# EAGLE design PulseFit (EAGLE 9.6.2)
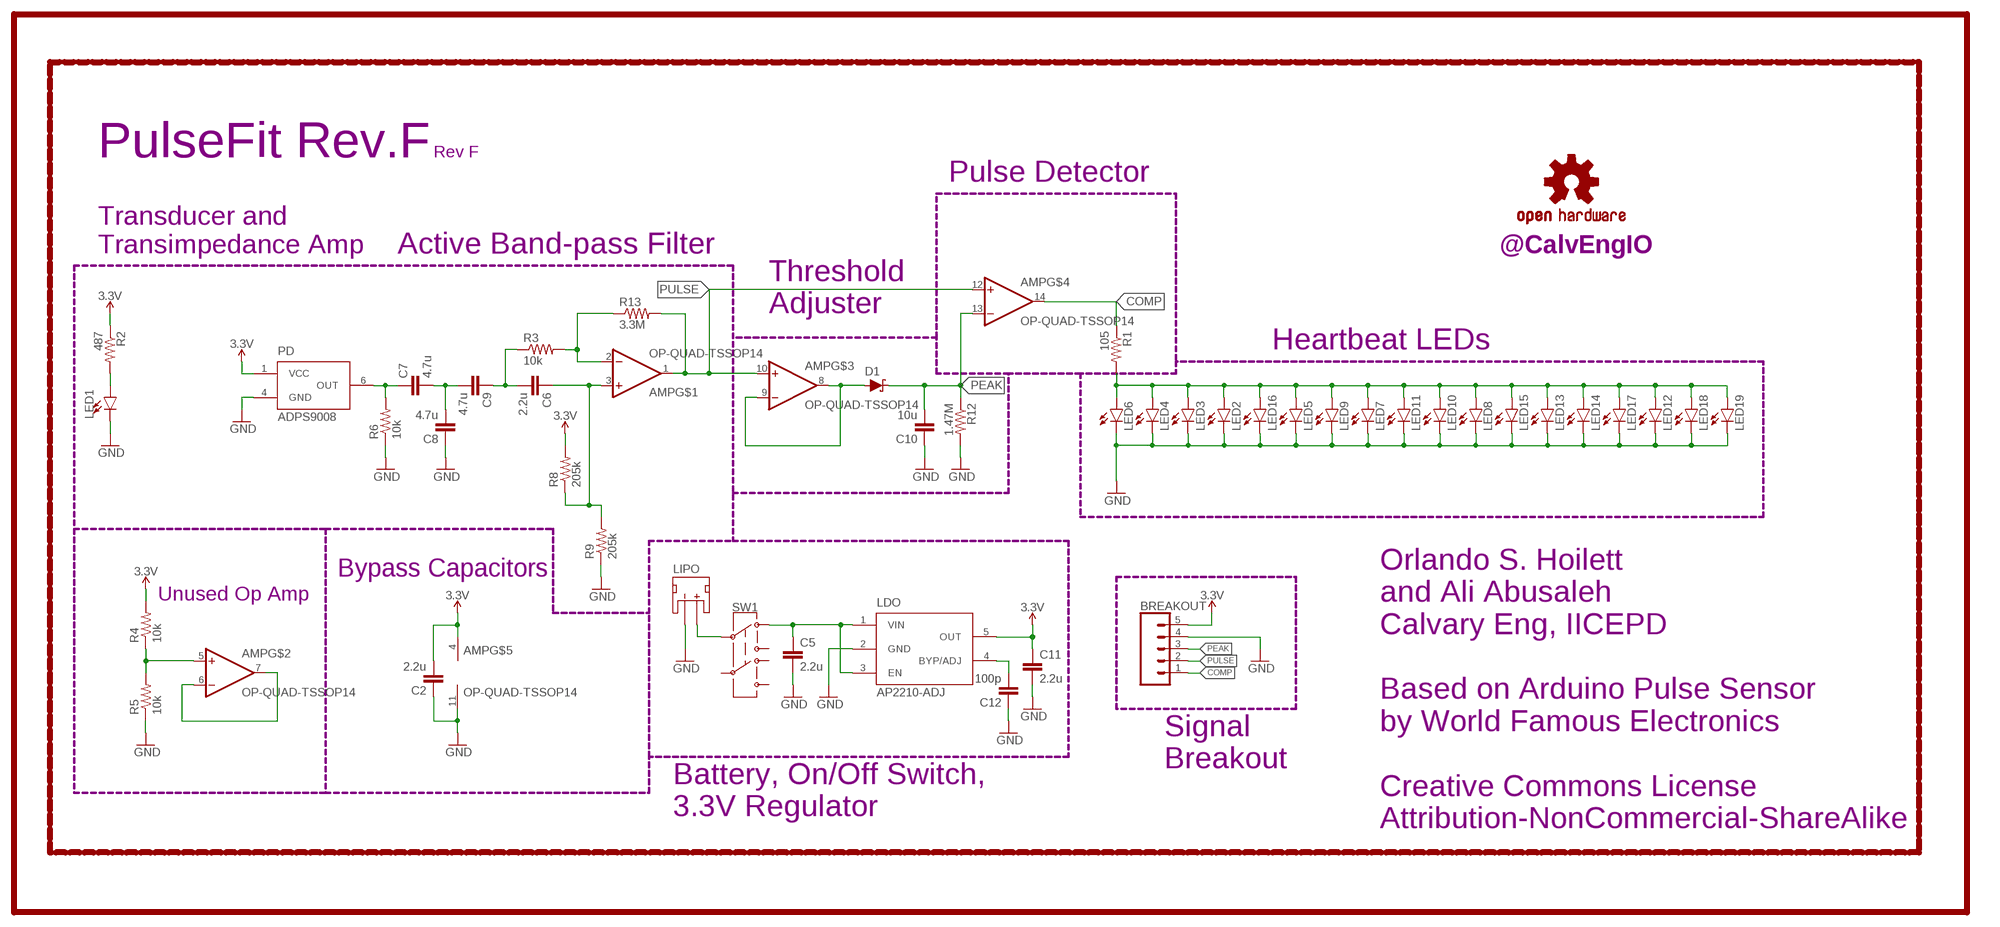
[diagram p0: schematic, sheet 1]

## Parts
AMP  OP-QUAD-TSSOP14  [TSSOP14]
BREAKOUT  CONN_05NO_SILK  [1X05_NO_SILK]
C2  2.2u  CAPACITOR0402  [C0402]
C5  2.2u  CAPACITOR0603  [C0603]
C6  2.2u  CAPACITOR0603  [C0603]
C7  4.7u  CAPACITOR0603  [C0603]
C8  4.7u  CAPACITOR0603  [C0603]
C9  4.7u  CAPACITOR0603  [C0603]
C10  10u  CAPACITOR0805  [C0805]
C11  2.2u  CAPACITOR0603  [C0603]
C12  100p  CAPACITOR0402  [C0402]
D1  SCHOTTKY-USC  [USC]
LDO  AP2210-ADJ  [SOT23-5]
LED1  LEDZ-BEND  [2-SMD.Z-BEND]
LED2  LED5MM  [LED5MM]
LED3  LED5MM  [LED5MM]
LED4  LED5MM  [LED5MM]
LED5  LED5MM  [LED5MM]
LED6  LED5MM  [LED5MM]
LED7  LED5MM  [LED5MM]
LED8  LED5MM  [LED5MM]
LED9  LED5MM  [LED5MM]
LED10  LED5MM  [LED5MM]
LED11  LED5MM  [LED5MM]
LED12  LED5MM  [LED5MM]
LED13  LED5MM  [LED5MM]
LED14  LED5MM  [LED5MM]
LED15  LED5MM  [LED5MM]
LED16  LED5MM  [LED5MM]
LED17  LED5MM  [LED5MM]
LED18  LED5MM  [LED5MM]
LED19  LED5MM  [LED5MM]
LIPO  JST_2MM_MALE  [JST-2-SMD]
LOGO1  OSHW-LOGOS  [OSHW-LOGO-S]
PD  ADPS9008  [6-PIN.CHIPLED]
R1  105  RESISTOR0402  [R0402]
R2  487  RESISTOR0402  [R0402]
R3  10k  RESISTOR0402  [R0402]
R4  10k  RESISTOR0402  [R0402]
R5  10k  RESISTOR0402  [R0402]
R6  10k  RESISTOR0402  [R0402]
R8  205k  RESISTOR0402  [R0402]
R9  205k  RESISTOR0402  [R0402]
R12  1.47M  RESISTOR0402  [R0402]
R13  3.3M  RESISTOR0402  [R0402]
SW1  SWITCH.JS202011JCQN  [SWITCH.00]
U$1  CALVENGIO_HANDLEHANDLE.05  [CALVENGIO_HANDLE.05]
U$2  REVISION.F  [REV.F]

## Nets
3.3V: AMP.4(V+) BREAKOUT.5 C2.2 C11.1 LDO.5(OUT) PD.1(VCC) R2.1 R4.2 R8.2
ANODE: LED2.A LED3.A LED4.A LED5.A LED6.A LED7.A LED8.A LED9.A LED10.A LED11.A LED12.A LED13.A LED14.A LED15.A LED16.A LED17.A LED18.A LED19.A R1.2
COMP: AMP.14(OUT) BREAKOUT.1 R1.1
GND: AMP.11(V-) BREAKOUT.4 C2.1 C5.2 C8.1 C10.1 C11.2 C12.1 LDO.2(GND) LED1.-(C) LED2.K(C) LED3.K(C) LED4.K(C) LED5.K(C) LED6.K(C) LED7.K(C) LED8.K(C) LED9.K(C) LED10.K(C) LED11.K(C) LED12.K(C) LED13.K(C) LED14.K(C) LED15.K(C) LED16.K(C) LED17.K(C) LED18.K(C) LED19.K(C) LIPO.1(-) PD.4(GND) R5.1 R6.1 R9.1 R12.2
N$1: AMP.5(+IN) R4.1 R5.2
N$2: AMP.6(-IN) AMP.7(OUT)
N$3: C12.2 LDO.4(BYP/ADJ)
N$4: LIPO.2(+) SW1.2
N$5: LED1.+(A) R2.2
N$10: AMP.8(OUT) AMP.9(-IN) D1.+(A)
N$11: C5.1 LDO.1(VIN) LDO.3(EN) SW1.1
N$13: C7.2 C8.2 C9.2
N$14: C6.2 C9.1 R3.1
N$15: AMP.2(-IN) R3.2 R13.1
N$17: AMP.3(+IN) C6.1 R8.1 R9.2
N$18: C7.1 PD.6(OUT) R6.2
PEAK: AMP.13(-IN) BREAKOUT.3 C10.2 D1.-(C) R12.1
PULSE: AMP.1(OUT) AMP.10(+IN) AMP.12(+IN) BREAKOUT.2 R13.2
Unconnected: LIPO.NC1(PAD1) LIPO.NC2(PAD2) SW1.3 SW1.5 SW1.6 SW1.7

## Notes on the sheet
- PulseFit Rev.F
- Pulse Detector
- Transducer and
  Transimpedance Amp
- Active Band-pass Filter
- Threshold
  Adjuster
- Heartbeat LEDs
- Bypass Capacitors
- Unused Op Amp
- Signal
  Breakout
- Battery, On/Off Switch,
  3.3V Regulator
- Orlando S. Hoilett
  and Ali Abusaleh
  Calvary Eng, IICEPD
  
  Based on Arduino Pulse Sensor
  by World Famous Electronics
  
  Creative Commons License
  Attribution-NonCommercial-ShareAlike

## Library data of the parts
AMP = CalvEngIO-AnalogIC:OP-QUAD: General symbol and footprints for Quad Op Amps. Use with any standard general purpose op amp.
BREAKOUT = CalvEngIO-Connectors:CONN_05: Multi connection point. Often used as Generic Header-pin footprint for 0.1 inch spaced/style header connections On any of the 0.1 inch spaced packages, you can populate with these: Break Away Headers - Straight <https://www.sparkfun.com/products/116> (PRT-00116) Break Away Male Headers - Right Angle <https://www.sparkfun.com/products/553> (PRT-00553) Female Headers <https://www.sparkfun.com/products/115> (PRT-00115) Break Away Headers - Machine Pin <https://www.sparkfun.com/products/117> (PRT-00117) Break Away Female Headers - Swiss Machine Pin <https://www.sparkfun.com/products/743> (PRT-00743) For SCREWTERMINALS and SPRING TERMINALS visit here: Screw Terimnals on SparkFun.com <https://www.sparkfun.com/search/results?term=Screw+Terminals> (5mm/3.5mm/2.54mm spacing) This device is also useful as a general connection point to wire up your design to another part of your project. Our various solder wires solder well into these plated through hole pads. Hook-Up Wire - Assortment (Stranded, 22 AWG) <https://www.sparkfun.com/products/11375> (PRT-11375) Hook-Up Wire - Assortment (Solid Core, 22 AWG) <https://www.sparkfun.com/products/11367> (PRT-11367) View the entire wire category on our website here <https://www.sparkfun.com/categories/141> Special notes: Molex polarized connector foot print use with SKU : PRT-08231 with associated crimp pins and housings. 1MM SMD Version SKU: PRT-10208
C2 C5-C12 = CalvEngIO-Passives:CAPACITOR
D1 = CalvEngIO-DiscreteSemi:SCHOTTKY: Schottky diode A Schottky diode is a semiconductor diode which has a low forward voltage drop and a very fast switching action. Example: Digi-Key Part Number: RB161MM-20CT-ND
LDO = CalvEngIO-Power:AP2210-ADJ
LED1 = CalvEngIO-LED:LED: LED (Generic) Standard schematic elements and footprints for 5mm, 3mm, 1206, and 0603 sized LEDs. Generic LEDs with no color specified. LTST-C190KGKT: arrow indicates cathode
LED2-LED19 = SparkFun-LED:LED: LEDs Standard schematic elements and footprints for 5mm, 3mm, 1206, and 0603 sized LEDs. 5mm - Spark Fun Electronics SKU : COM-00529 (and others)
LIPO = CalvEngIO-Connectors:JST_2MM_MALE: JST 2MM MALE RA CONNECTOR Two pin, compact surface mount connector. Commonly used as a battery input connection point. We really like the solid locking feeling and high current rating on these small connectors. We use these all the time as battery connectors. Mates to single-cell LiPo batteries. Here is the connector we sell at SparkFun: JST Right Angle Connector - White <https://www.sparkfun.com/products/8612> (PRT-08612) Datasheet <http://www.sparkfun.com/datasheets/Prototyping/Connectors/JST-Horizontal.pdf> It was used on these SparkFun products: SparkFun MOSFET Power Controller <https://www.sparkfun.com/products/11214> (PRT-11214) SparkFun Battery Babysitter - LiPo Battery Manager <https://www.sparkfun.com/products/13777> (PRT-13777) And many, many others that required a lipo battery connection.; PROD_ID: CONN-11443; SF_ID: PRT-08612
LOGO1 = SparkFun-Aesthetics:OSHW-LOGO: Open Source Hardware Logo This logo indicates the piece of hardware it is found on incorporates a OSHW license and/or adheres to the definition of open source hardware found here: http://freedomdefined.org/OSHW
PD = CalvEngIO-Sensors:ADPS9008
R1-R6 R8 R9 R12 R13 = CalvEngIO-Passives:RESISTOR
SW1 = CalvEngIO-Switches:SWITCH.JS202011JCQN
U$1 = CalvEngIO-Logos:CALVENGIO_HANDLE
U$2 = CalvEngIO-Logos:REVISION.F

## Board
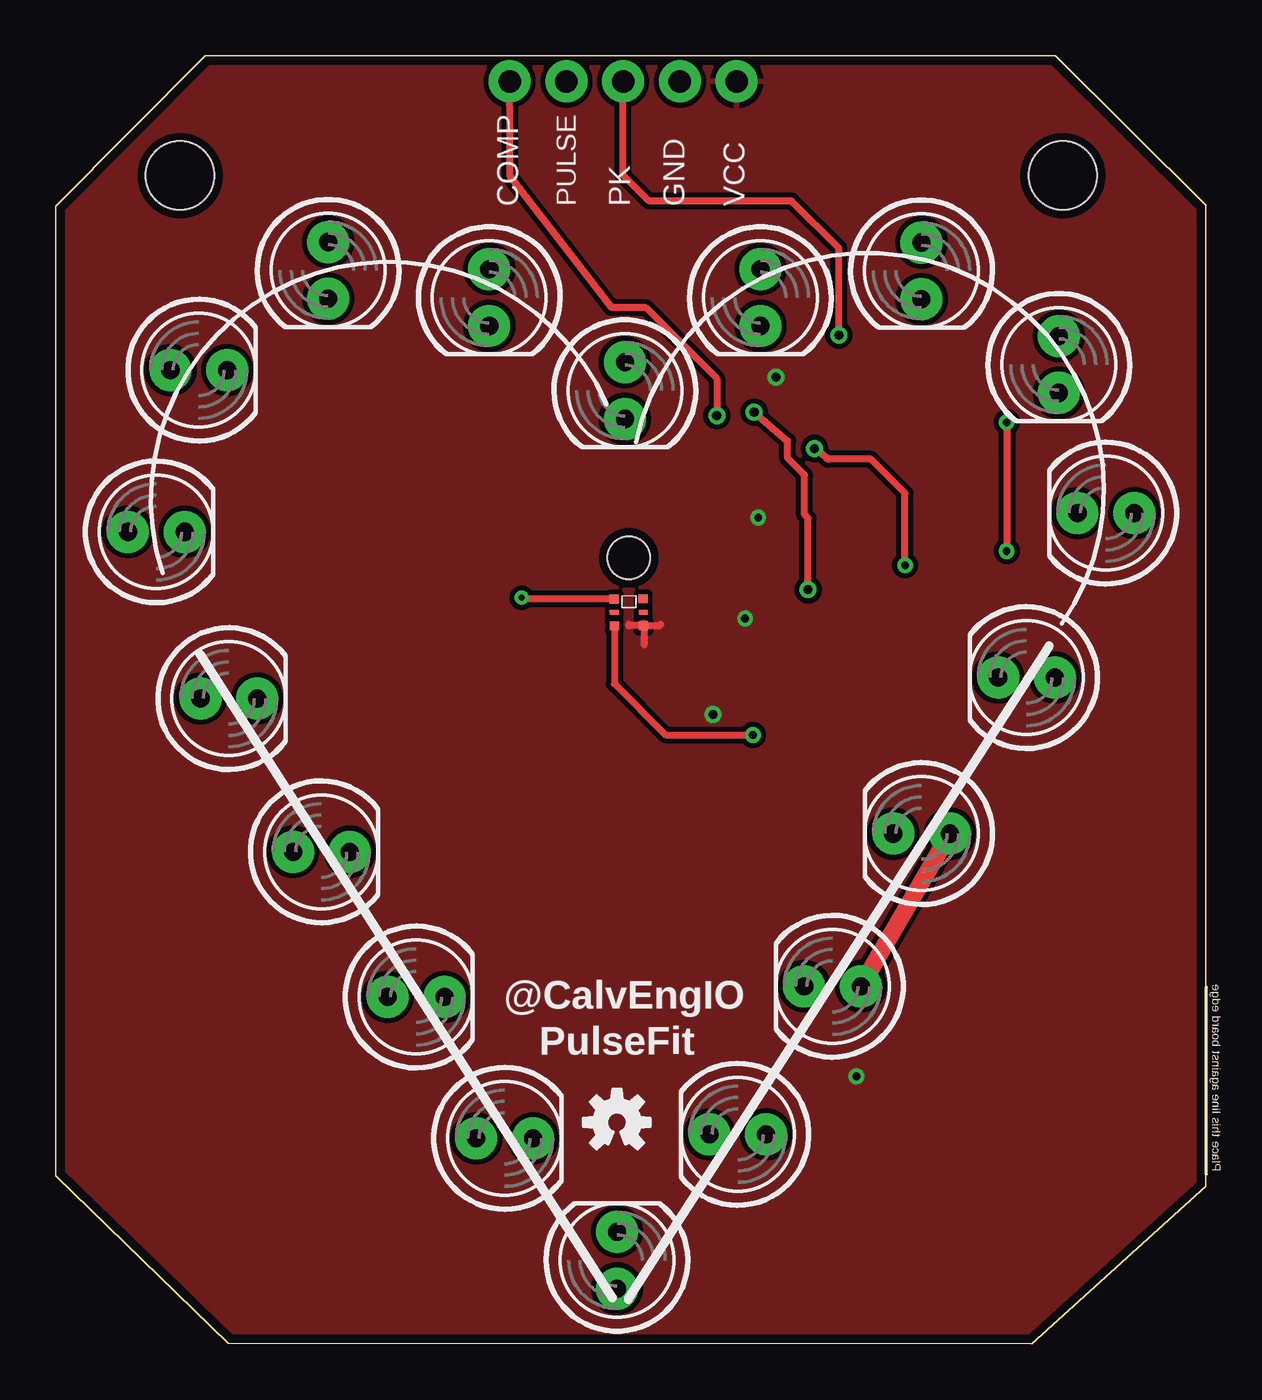
[diagram p1: board, top side]
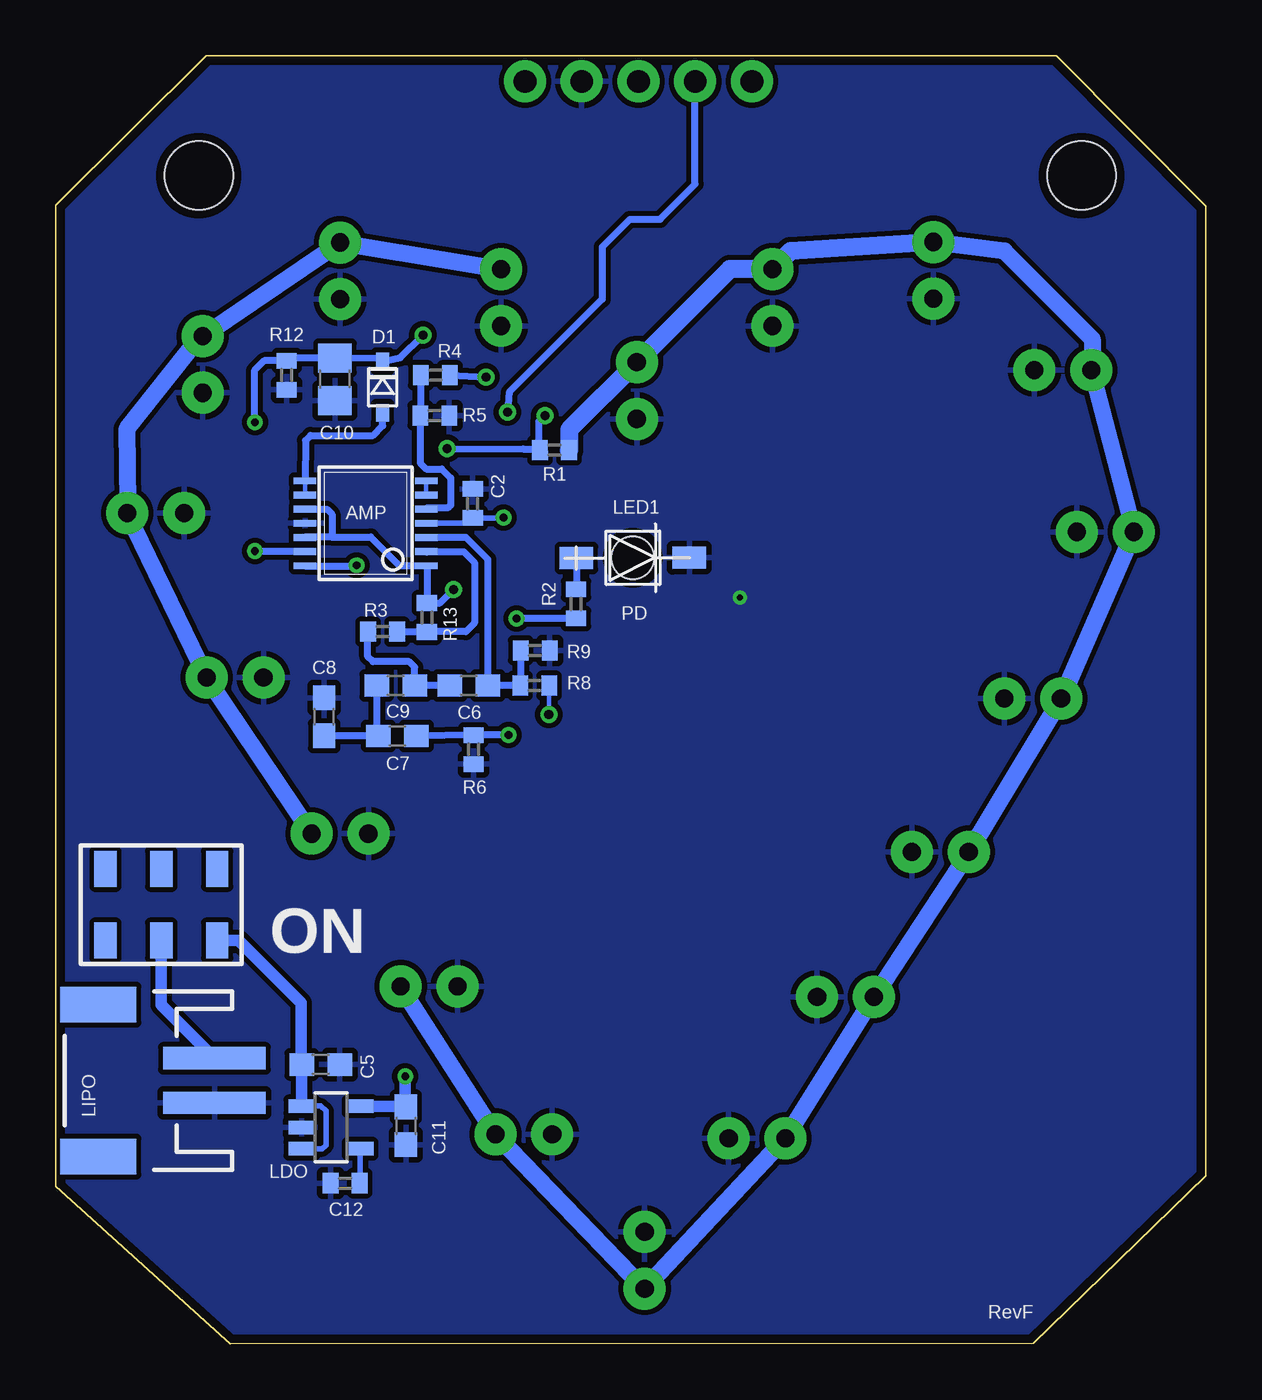
[diagram p2: board, bottom side, seen from below]

Size 51.49 x 57.66 mm. Coordinates in mm from the lower left corner, seen from the top.
Outline: 43.69,0 51.49,7.04 51.49,50.98 44.75,57.66 6.68,57.66 0,50.93 0,7.52 7.72,0.03 43.66,0
Copper layers (1*16): Top 0.0356mm / dielectric 1.5011mm / Bottom 0.0356mm
Design rules "LaenPCBOrder": minimum track width 6mil, minimum drill 13mil, track to track 6mil, track to pad 6mil, pad to pad 6mil, via to via 6mil, smd to smd 6mil, copper to edge 15mil, drill to drill 6mil, minimum pad ring 7mil, minimum via ring 7mil, stop-mask expansion 3mil, vias tented up to drill 0mil, thermal gap 10mil
Holes 3.05 mm at 5.56,52.3 45.08,52.3

### Footprints (pad centres in the part's own frame; a part is rotated, then mirrored left to right if it is on the bottom)
TSSOP14 = smd 0.305 x 0.991: 1 -1.905,-2.718; 2 -1.27,-2.718; 3 -0.635,-2.718; 4 0,-2.718; 5 0.635,-2.718; 6 1.27,-2.718; 7 1.905,-2.718; 8 1.905,2.718; 9 1.27,2.718; 10 0.635,2.718; 11 0,2.718; 12 -0.635,2.718; 13 -1.27,2.718; 14 -1.905,2.718
1X05_NO_SILK = drill 1.016 pad 1.88: 1 0,0; 2 2.54,0; 3 5.08,0; 4 7.62,0; 5 10.16,0
C0402 = smd 0.7 x 0.9: 1 -0.65,0; 2 0.65,0
C0603 = smd 1.1 x 1: 1 -0.85,0; 2 0.85,0
C0805 = smd 1.3 x 1.5: 1 -0.95,0; 2 0.95,0
USC = smd 0.8 x 0.6: + -1.15,0; - 1.15,0
SOT23-5 = smd 0.6 x 1.2: 1 -0.95,-1.306; 2 0,-1.306; 3 0.95,-1.306; 4 0.95,1.306; 5 -0.95,1.306
2-SMD.Z-BEND = smd 1.5 x 1: + -2.525,0; - 2.525,0 | hole 1.9: 0,0
LED5MM = drill 0.813 pad 1.88: A -1.27,0; K 1.27,0
JST-2-SMD = smd 1 x 4.6: 1 -1,-3.7; 2 1,-3.7 | smd 1.6 x 3.4: NC1 -3.4,1.5; NC2 3.4,1.5
6-PIN.CHIPLED = smd 0.4 x 0.4: 1 0.6,0.65; 3 -0.6,0.65; 4 -0.6,-0.65; 6 0.6,-0.65 | smd 0.2 x 0.4: 2 0,0.65; 5 0,-0.65
R0402 = smd 0.7 x 0.9: 1 -0.65,0; 2 0.65,0
SWITCH.00 = smd 1 x 1.6: 1 -2.5,1.6; 2 0,1.6; 3 2.5,1.6; 5 -2.5,-1.6; 6 0,-1.6; 7 2.5,-1.6

### Placement (x,y rotation side)
AMP  37.62,36.73 90 bottom
BREAKOUT  20.32,56.52 0 top
C2  32.82,37.62 270 bottom
C5  39.62,12.5 0 bottom
C6  32.99,29.46 180 bottom
C7  36.2,27.2 180 bottom
C8  39.47,28.07 270 bottom
C9  36.27,29.46 180 bottom
C10  38.99,43.18 90 bottom
C11  35.81,9.75 270 bottom
C12  38.53,7.19 0 bottom
D1  36.86,42.82 90 bottom
LDO  39.17,9.68 270 bottom
LED1  25.65,35.18 0.2 bottom
LED2  25.48,42.67 270 top
LED3  31.55,46.84 270 top
LED4  38.76,48.03 270 top
LED5  44.91,43.84 270 top
LED6  47.02,37.19 180 top
LED7  43.46,29.82 180 top
LED8  38.76,22.83 180 top
LED9  34.77,16 180 top
LED10  30.53,9.37 180 top
LED11  25.12,3.73 90 top
LED12  20.09,9.19 0 top
LED13  16.13,15.52 0 top
LED14  11.89,22.02 0 top
LED15  7.75,28.88 0 top
LED16  4.5,36.35 0 top
LED17  6.4,43.59 0 top
LED18  12.19,48.06 270 top
LED19  19.41,46.84 270 top
LIPO  48.08,11.78 90 bottom
LOGO1  25.12,9.91 0 top
PD  25.65,32.75 270.5 top
R1  29.16,40.01 0.1 bottom
R2  28.19,33.12 90 bottom
R3  36.86,31.88 0 bottom
R4  34.49,43.36 0 bottom
R5  34.52,41.55 180 bottom
R6  32.79,26.59 90 bottom
R8  30.05,29.46 0 bottom
R9  30.02,31.04 180 bottom
R12  41.15,43.36 270 bottom
R13  34.87,32.51 90 bottom
SW1  46.76,19.66 180 bottom
U$1  25.12,14.99 0 top
U$2  9.75,1.12 0 bottom

### Tracks (layer width: path | path; a pad name or v marks a point on that pad's centre or on a via)
3.3V  (via drill 0.35, 0.41)
  Top 0.305: 27.08,32.21 27.02,32.15 PD.1 | PD.1 26.34,32.15 26.34,31.29 | PD.1 25.65,32.15 25.65,32.21
  Bottom 0.203: R8.2 29.4,28.18 v29.41,28.17
  Bottom 0.254: AMP.4 33.06,36.73 C2.2 31.46,36.97 v31.45,36.98
  Bottom 0.305: R4.2 v32.23,43.28 | R2.1 30.85,32.47 v30.86,32.46
  Bottom 0.508: LDO.5 35.84,10.63 | 35.84,10.63 C11.1 | 35.84,10.63 v35.84,11.96
  pour Top (isolate 0.229): -1.96,60.86 53.54,60.86 53.54,-1.19 -1.96,-1.19
ANODE
  Top 0.762: LED9.A LED8.A
  Bottom 0.762: LED18.A 9.02,48.92 5.08,44.98 5.08,43.64 LED17.A LED16.A LED15.A LED14.A LED13.A LED12.A LED11.A LED10.A LED9.A | LED8.A LED7.A LED6.A 48.26,37.59 48.31,40.95 45.03,45.09 LED5.A LED4.A LED3.A
  Bottom 0.813: LED18.A 18.59,48.92 LED19.A 21.31,48.11 LED2.A 28.5,40.92 28.5,40.02 R1.2
COMP  (via drill 0.35, 0.41)
  Top 0.305: v33.96,40.08 34.54,39.62 34.57,39.6 36.5,39.6 38.02,38.08 v38.02,34.85 | BREAKOUT.1 20.35,54.33 20.35,52.25 24.87,46.41 26.39,46.41 29.59,43.21 v29.59,41.55
  Bottom 0.305: v33.96,40.08 30.56,40.06 29.86,40.06 | 29.86,40.06 R1.1 | 29.86,40.06 29.86,41.28 v29.59,41.55 | AMP.14 38.05,34.82 v38.02,34.85
GND  (via drill 0.28)
  Top 0.305: PD.4 20.91,33.34 v20.85,33.4
  pour Bottom (isolate 0.229): -0.61,51.33 4.42,58.45 45.21,58.45 51.87,49.86 52.1,6.07 46.13,0.38 6.65,0.3 -0.41,5.36
N$1
  Bottom 0.305: R4.1 R5.2 35.17,39.44 34.9,39.17 34.21,39.17 33.81,38.76 33.81,37.54 33.93,37.41 34.85,37.41 AMP.5
N$2
  Bottom 0.203: AMP.7 AMP.6
N$3
  Bottom 0.254: LDO.4 37.86,7.21 C12.2
N$4
  Bottom 0.508: SW1.2 46.76,15.16 LIPO.2
N$5
  Bottom 0.305: LED1.+ 28.18,33.79 R2.2
N$10
  Bottom 0.203: AMP.8 AMP.9
  Bottom 0.305: AMP.8 40.31,40.44 40.08,40.66 37.29,40.66 36.86,41.1 D1.+
N$11
  Bottom 0.254: LDO.3 39.56,8.73 39.4,8.89 39.4,10.41 39.62,10.64 40.46,10.64 LDO.1
  Bottom 0.508: LDO.1 C5.1 40.51,12.54 40.51,15.27 43.31,18.06 SW1.1
N$13
  Bottom 0.305: C9.2 37.12,27.28 C7.2 39.46,27.2 C8.2
N$14
  Bottom 0.305: R3.1 37.52,30.76 37.29,30.53 35.66,30.53 35.42,30.29 C9.1 C6.2
N$15
  Bottom 0.305: 34.87,35.43 AMP.2 33.22,35.46 32.74,34.98 32.74,32.26 33.12,31.88 34.86,31.88 R13.1 36.19,31.86 R3.2
N$17
  Bottom 0.305: AMP.3 33.12,36.09 32.14,35.12 C6.1 R8.1 30.67,29.49 R9.2
N$18  (via drill 0.35)
  Top 0.305: PD.6 25.01,29.55 27.31,27.25 v31.22,27.25
  Bottom 0.305: C7.1 R6.2 32.78,27.25 v31.22,27.25
PEAK  (via drill 0.35, 0.41)
  Top 0.305: v35.05,45.16 35.05,49.05 32.94,51.16 26.57,51.16 25.4,52.32 BREAKOUT.3 | v42.57,41.25 v42.57,35.48
  Bottom 0.305: v35.05,45.16 36.07,44.15 D1.- 36.85,44.11 C10.2 41.03,44.13 R12.1 42.15,44.01 42.6,43.56 42.6,41.28 v42.57,41.25 | v42.57,35.48 40.36,35.48 AMP.13
PULSE  (via drill 0.41)
  Top 0.305: v31.27,41.71 32.77,40.41 32.77,39.65 33.53,38.89 33.53,37.11 33.68,36.96 v33.68,33.76
  Bottom 0.305: v33.68,33.76 34.28,33.16 R13.2 34.87,34.8 AMP.1 36.09,34.82 37.39,36.12 39.17,36.12 | v31.27,41.71 31.19,42.6 27.03,46.76 27.03,49.1 25.78,50.34 24.43,50.34 22.86,51.92 BREAKOUT.2 | 39.17,36.12 40.31,36.12 AMP.12 | AMP.10 39.34,37.36 39.12,37.14 39.12,36.17 39.17,36.12

### Text on the board
bPlace: ON
_tsilk: COMP | PULSE | PK | GND | VCC | PulseFit